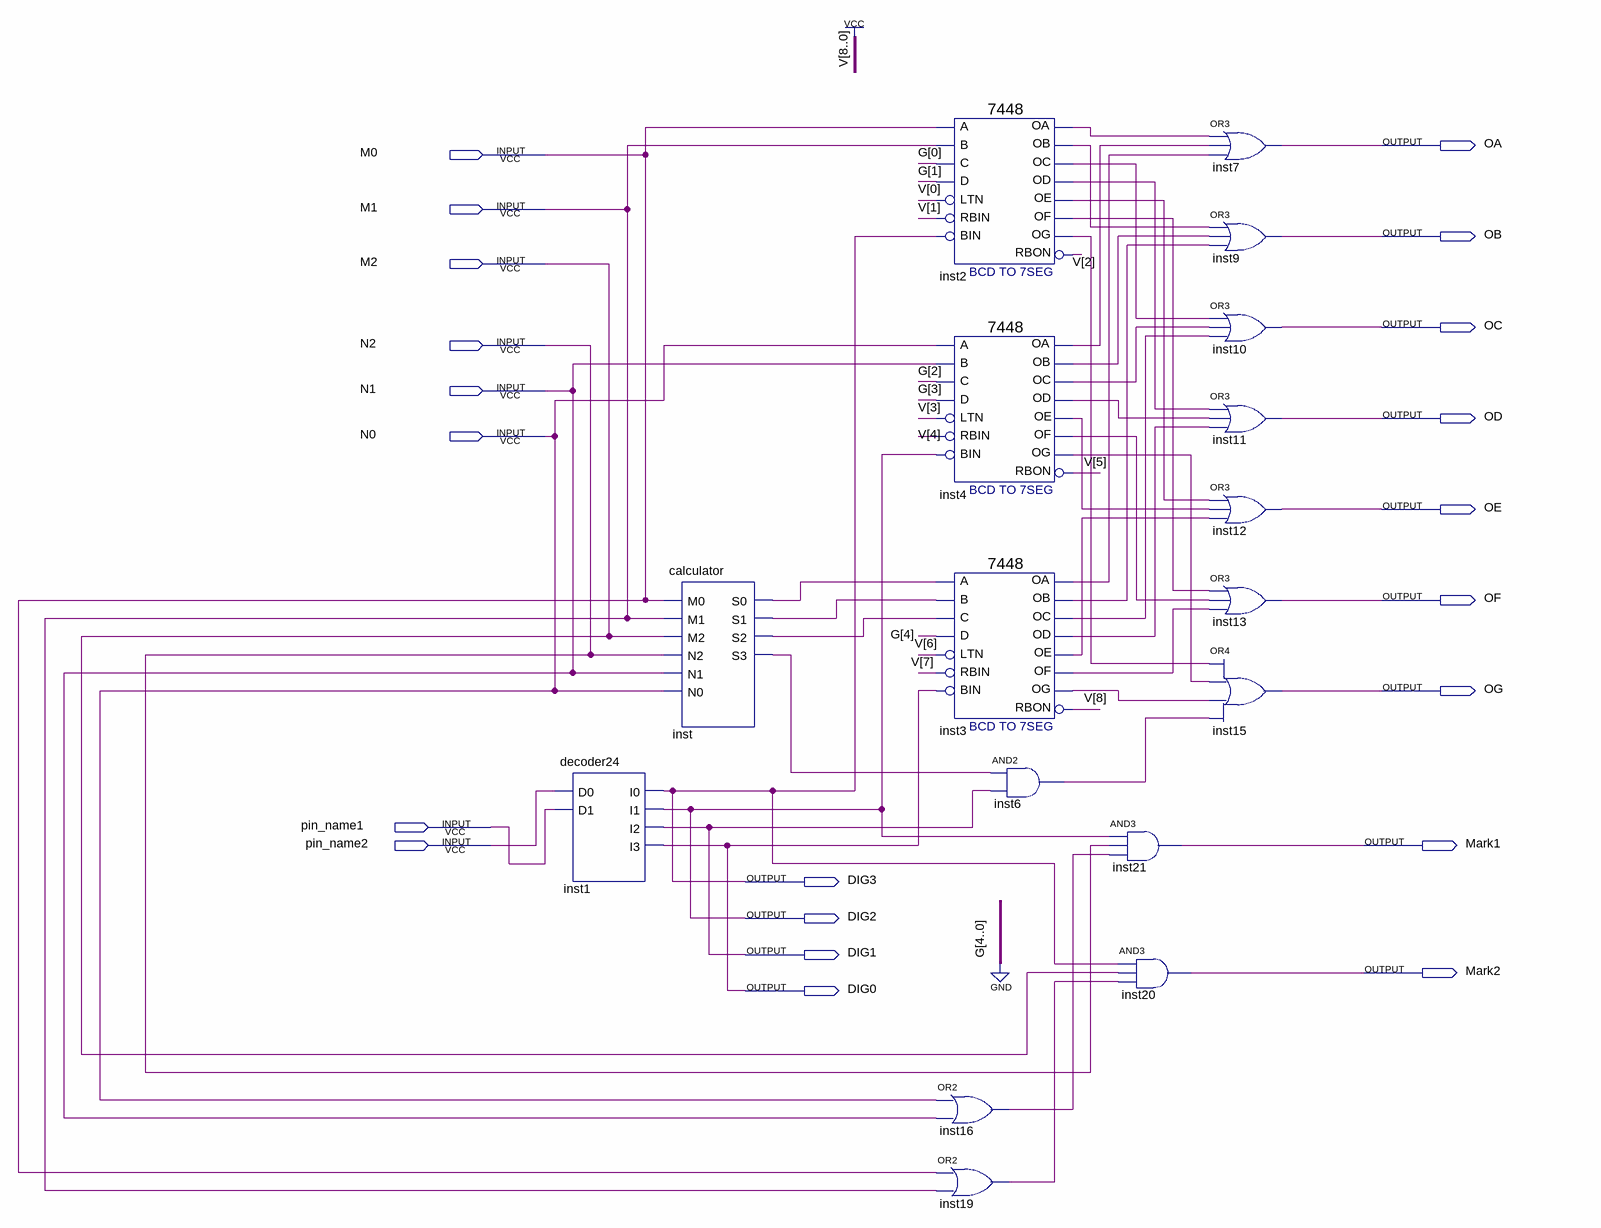
[diagram p0: schematic sheet]
// Quartus schematic all.bdf as structural Verilog: 17 symbols, 21 pins
module all (
  input  M0,
  input  M1,
  input  M2,
  input  N2,
  input  N1,
  input  N0,
  input  pin_name1,
  input  pin_name2,
  output OA,
  output OB,
  output OC,
  output OD,
  output OE,
  output OF,
  output OG,
  output Mark1,
  output DIG3,
  output DIG2,
  output DIG1,
  output Mark2,
  output DIG0
);

  wire inst2_oa, inst2_ob, inst2_oc, inst2_od, inst2_oe, inst2_of, inst2_og, inst3_oa, inst3_ob, inst3_oc,
       inst3_od, inst3_oe, inst3_of, inst3_og, inst4_oa, inst4_ob, inst4_oc, inst4_od, inst4_oe, inst4_of,
       inst4_og, inst6_out, inst16_out, inst19_out, inst_s0, inst_s1, inst_s2, inst_s3;
  wire [8:2] V;

  decoder24 inst1 (.D0(pin_name2), .D1(pin_name1), .I0(DIG3), .I1(DIG2), .I2(DIG1), .I3(DIG0));
  calculator inst (
    .M0(M0), .M1(M1), .M2(M2), .N2(N2), .N1(N1), .N0(N0), .S0(inst_s0), .S1(inst_s1), .S2(inst_s2),
    .S3(inst_s3));
  \7448  inst2 (
    .A(M0), .C(1'b0), .D(1'b0), .B(M1), .RBIN(1'b1), .BIN(DIG3), .LTN(1'b1), .OC(inst2_oc), .OE(inst2_oe),
    .OD(inst2_od), .OF(inst2_of), .OG(inst2_og), .OB(inst2_ob), .OA(inst2_oa), .RBON(V[2]));
  \7448  inst4 (
    .A(N0), .C(1'b0), .D(1'b0), .B(N1), .RBIN(1'b1), .BIN(DIG2), .LTN(1'b1), .OC(inst4_oc), .OE(inst4_oe),
    .OD(inst4_od), .OF(inst4_of), .OG(inst4_og), .OB(inst4_ob), .OA(inst4_oa), .RBON(V[5]));
  \7448  inst3 (
    .A(inst_s0), .C(inst_s2), .D(1'b0), .B(inst_s1), .RBIN(1'b1), .BIN(DIG0), .LTN(1'b1), .OC(inst3_oc),
    .OE(inst3_oe), .OD(inst3_od), .OF(inst3_of), .OG(inst3_og), .OB(inst3_ob), .OA(inst3_oa), .RBON(V[8]));
  and inst6 (inst6_out, inst_s3, DIG1);
  or inst16 (inst16_out, N0, N1);
  or inst19 (inst19_out, M0, M1);
  and inst21 (Mark1, DIG2, N2, inst16_out);
  and inst20 (Mark2, DIG3, M2, inst19_out);
  or inst7 (OA, inst2_oa, inst4_oa, inst3_oa);
  or inst9 (OB, inst2_ob, inst4_ob, inst3_ob);
  or inst10 (OC, inst2_oc, inst4_oc, inst3_oc);
  or inst11 (OD, inst2_od, inst4_od, inst3_od);
  or inst12 (OE, inst2_oe, inst4_oe, inst3_oe);
  or inst13 (OF, inst2_of, inst4_of, inst3_of);
  or inst15 (OG, inst2_og, inst4_og, inst3_og, inst6_out);
  // also tied to VCC on the sheet: {V[2], V[5], V[8]}
endmodule
